# Altium schematic sheet MCU.SchDoc
size A4; SheetNumber: 2; SheetTotal: 3
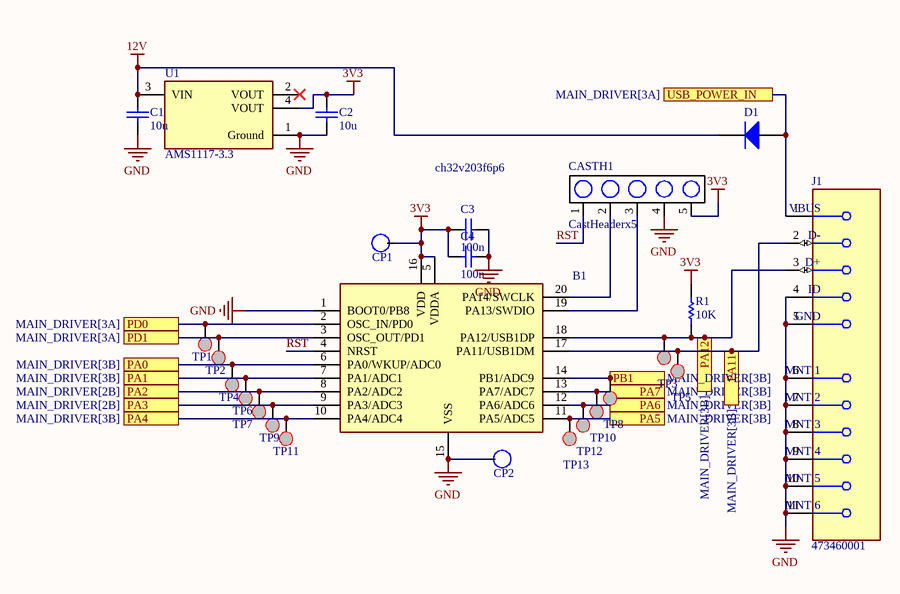
[diagram p0: MCU.SchDoc]

## Parts
B1  ch32v203f6p6  [SOP65P640X110-20N]
C1  value 10u  [CAP FILM 0603_1608]  (hidden comment: Capacitor)
C2  value 10u  [CAP FILM 0603_1608]  (hidden comment: Capacitor)
C3  value 100n  [SMD-0603-RES]  (hidden comment: Capacitor)
C4  value 100n  [SMD-0603-RES]  (hidden comment: Capacitor)
CASTH1  CastHeaderx5  [CASTHEADERX5]
CP1  CONNECT_PAD  [PAD_SQUARE]  (value not drawn)
CP2  CONNECT_PAD  [PAD_SQUARE]  (value not drawn)
D1  FR107  [SODFL365X110-2N]  (value not drawn)
J1  473460001  [FP-473460001-MFG]
R1  value 10K  [SMD-0603-RES]  (hidden comment: Resistor)
TP1  (no value)  [ROUND_SMALL]
TP2  (no value)  [ROUND_SMALL]
TP3  (no value)  [ROUND_SMALL]
TP4  (no value)  [ROUND_SMALL]
TP5  (no value)  [ROUND_SMALL]
TP6  (no value)  [ROUND_SMALL]
TP7  (no value)  [ROUND_SMALL]
TP8  (no value)  [ROUND_SMALL]
TP9  (no value)  [ROUND_SMALL]
TP10  (no value)  [ROUND_SMALL]
TP11  (no value)  [ROUND_SMALL]
TP12  (no value)  [ROUND_SMALL]
TP13  (no value)  [ROUND_SMALL]
U1  AMS1117-3.3  [FP-AMS1117-IPC_C]

## Ports
PA0 (see MAIN_DRIVER[3B]), PA1 (see MAIN_DRIVER[3B]), PA2 (see MAIN_DRIVER[2B]), PA3 (see MAIN_DRIVER[2B]), PA4 (see MAIN_DRIVER[3B]), PA5 (see MAIN_DRIVER[3B]), PA6 (see MAIN_DRIVER[3B]), PA7 (see MAIN_DRIVER[3B]), PA11 (see MAIN_DRIVER[3B]), PA12 (see MAIN_DRIVER[3B]), PB1 (see MAIN_DRIVER[3B]), PD0 (see MAIN_DRIVER[3A]), PD1 (see MAIN_DRIVER[3A]), USB_POWER_IN (see MAIN_DRIVER[3A])

## Nets
3V3: B1.5(VDDA) B1.16(VDD) C2.2 C3.1 C4.1 CASTH1.5 CP1.1 R1.2 U1.4(VOUT)
12V: C1.2 D1.2(K) U1.3(VIN)
GND: B1.1(BOOT0/PB8) B1.15(VSS) C1.1 C2.1 C3.2 C4.2 CASTH1.4 CP2.1 J1.4(ID) J1.5(GND) J1.6(MNT_1) J1.7(MNT_2) J1.8(MNT_3) J1.9(MNT_4) J1.10(MNT_5) J1.11(MNT_6) U1.1(Ground)
PA0: B1.6(PA0/WKUP/ADC0) TP4.1(Test_Point) ; port PA0
PA1: B1.7(PA1/ADC1) TP6.1(Test_Point) ; port PA1
PA2: B1.8(PA2/ADC2) TP7.1(Test_Point) ; port PA2
PA3: B1.9(PA3/ADC3) TP9.1(Test_Point) ; port PA3
PA4: B1.10(PA4/ADC4) TP11.1(Test_Point) ; port PA4
PA5: B1.11(PA5/ADC5) TP13.1(Test_Point) ; port PA5
PA6: B1.12(PA6/ADC6) TP12.1(Test_Point) ; port PA6
PA7: B1.13(PA7/ADC7) TP10.1(Test_Point) ; port PA7
PA11: B1.17(PA11/USB1DM) J1.2(D+) TP5.1(Test_Point) ; port PA11
PA12: B1.18(PA12/USB1DP) J1.3(D-) R1.1 TP3.1(Test_Point) ; port PA12
PB1: B1.14(PB1/ADC9) TP8.1(Test_Point) ; port PB1
PD0: B1.2(OSC_IN/PD0) TP1.1(Test_Point) ; port PD0
PD1: B1.3(OSC_OUT/PD1) TP2.1(Test_Point) ; port PD1
RST: B1.4(NRST) CASTH1.1
USB_POWER_IN: D1.1(A) J1.1(VBUS) ; port USB_POWER_IN
NetB1_19: B1.19(PA13/SWDIO) CASTH1.3
NetB1_20: B1.20(PA14/SWCLK) CASTH1.2

Not connected (* = marked no-connect by the designer): U1 2(VOUT)*

## Library data of the parts
B1 = ch32v203f6p6: 144MHz, Industrial-grade general-purpose microcontrollers TSSOP20 Package; Manufacturer_Name: WCH; Geometry.Height: 1.1mm; Manufacturer_Part_Number: ch32v203f6p6; Mouser Part Number: *; Mouser Price/Stock: *; Arrow Part Number: *; Arrow Price/Stock: *; Datasheet Link: https://data.electronshik.ru/z/Datasheet/C/CH32V203K8T6.PDF
C1-C4 = Capacitor: SimulationGenericComponent: True
D1 = Diode: AF: 1; BV: 0; BV_MAX: 1e99; EG: 1.11; FC: 0.5; IBV: 0.001; ISR: 1e-14; MJSW: 0.33; NTUN: 30; TNOM: 27; XTI: 3; SimulationGenericComponent: True; CJO: 0; CJP: 0; CTA: 0; CTP: 0; FCS: 0.5; FV_MAX: 1e99; IKF: 0; IKR: 0; JSW: 0; JTUN: 0; JTUNSW: 0; KEG: 1; KF: 0; LEVEL: 1; N: 1; NBV: 1; NR: 1; NS: 1; PHP: 1; RS: 0; TCV: 0; TLEV: 0; TLEVC: 0; TM1: 0; TM2: 0; TPB: 0; TPHP: 0; TRS: 0; TRS2: 0; TT: 0; TTT1: 0; TTT2: 0; VJ: 1; XTITUN: 3; IS: 1e-14
J1 = CMP-2000-05246-2: CONN RCPT USB2.0 MICRO B SMD R/A; Manufacturer: Molex; Conn Orientation: Right Angle; Is Female: yes; Shielding: true; Pitch: 0.65mm; Number Of Contacts: 5; Voltage Rating: 30V; Current Rating: 1.8A; Device Class L2: USB Connectors; Digikey Description: CONN RCPT USB2.0 MICRO B SMD R/A; Height: 2.945mm; RoHS: TRUE; ComponentLink2Description: Datasheet; Octopart: https://octopart.com/47346-0001-molex-7164928; Automotive: No; Package: 0; Category: Conn; Device Class L1: Connectors; Usb Standard: USB 2.0; Temperature: -30°C to +85°C; Temperature Range Low: -30°C; Footprint Url: https://www.molex.com/pdm_docs/sd/473460001_sd.pdf; ComponentLink2URL: https://www.molex.com/webdocs/datasheets/pdf/en-us/0473460001_IO_CONNECTORS.pdf; Lead Free: Yes; Manufacturer Part Number: 473460001; Contact Material: Gold,Nickel; Temperature Range High: +85°C; Device Class L3: unset
R1 = Resistor: TC1: 0; SimulationGenericComponent: True; TC2: 0
TP1-TP13 = TEST_PAD
U1 = CMP-209535-000001-1: LDO Voltage Regulators 1A, 3.3V; Manufacturer: Advanced Monolithic Systems; Dropout Voltage: 1.1V; Output Type: Fixed; Nominal Supply Current: 5mA; Max Power Dissipation: 1.2W; Max Supply Voltage: 15V; Number Of Outputs: 1; Standoff Height: 0.64mm; Max Junction Temp: +125°C; Height: 1.8mm; Package: AMS1117; Device Class L2: Power Management ICs; ComponentLink2Description: Datasheet; ComponentLink2URL: http://www.advanced-monolithic.com/pdf/ds1117.pdf; Category: IC; RoHS: TRUE; Automotive: No; Device Class L1: Integrated Circuits (ICs); Output Current: 1A; Device Class L3: Voltage Regulators - Linear; Temperature: -40°C to +125°C; Output Voltage: 3.3V; Manufacturer Part Number: AMS1117-3.3; Temperature Range Low: -40°C; Octopart: https://octopart.com/ams1117-3.3-advanced+monolithic+systems-25899300; Lead Free: Yes; Ipc Land Pattern Name: SOT229P700X180-4; Temperature Range High: +125°C